# Altium schematic sheet IPS-LCD-1.14寸裸屏模块.SchDoc
size A4
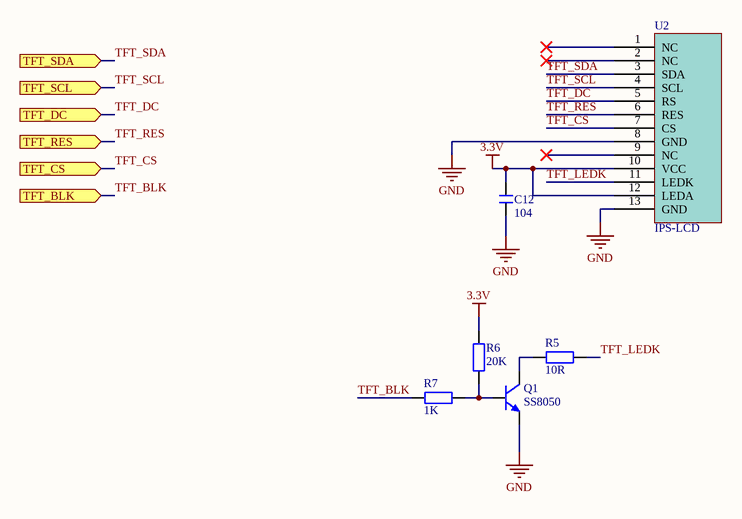
[diagram p0: IPS-LCD-1.14寸裸屏模块.SchDoc]

## Parts
C12  104  [C 0603_L]
Q1  SS8050  [SOT23-3N]
R5  10R  [R 0603_L]
R6  20K  [R 0603_L]
R7  1K  [R 0603_L]
U2  IPS-LCD  [1.14IPS-LCD]

## Ports
TFT_BLK (in), TFT_CS (in), TFT_DC (in), TFT_RES (in), TFT_SCL (in), TFT_SDA (in)

## Nets
3.3V: C12.1 R6.2 U2.10(VCC) U2.12(LEDA)
GND: C12.2 Q1.2(E) U2.8(GND) U2.13(GND)
TFT_BLK: R7.1 ; port TFT_BLK
TFT_CS: U2.7(CS) ; port TFT_CS
TFT_DC: U2.5(RS) ; port TFT_DC
TFT_LEDK: R5.1 U2.11(LEDK)
TFT_RES: U2.6(RES) ; port TFT_RES
TFT_SCL: U2.4(SCL) ; port TFT_SCL
TFT_SDA: U2.3(SDA) ; port TFT_SDA
NetQ1_1: Q1.1(B) R6.1 R7.2
NetQ1_3: Q1.3(C) R5.2

Not connected (* = marked no-connect by the designer): U2 1(NC)* 2(NC)* 9(NC)*

## Library data of the parts
C12 = C: 无极性贴片电容; 版权归属: 黎明电子style; BOM名称: 无极性贴片电容; 学习资源: https://lmdzstyle.taobao.com/
Q1 = 8050-SMD: 高频放大-NPN型 丝印J3Y; 版权归属: 源创客; 属性: 40V 1.5A 1W 100MHZ; BOM名称: 高频放大-NPN型; 学习资源: www.ooocke.com
R5-R7 = R: 贴片电阻; 版权归属: 黎明电子style; BOM名称: 贴片电阻; 学习资源: https://lmdzstyle.taobao.com/
U2 = IPS-LCD-1.14: IPS-LCD-1.14寸裸屏spi接口